# EAGLE schematic rozrobene_rfid_esp32 (EAGLE 9.0.1)
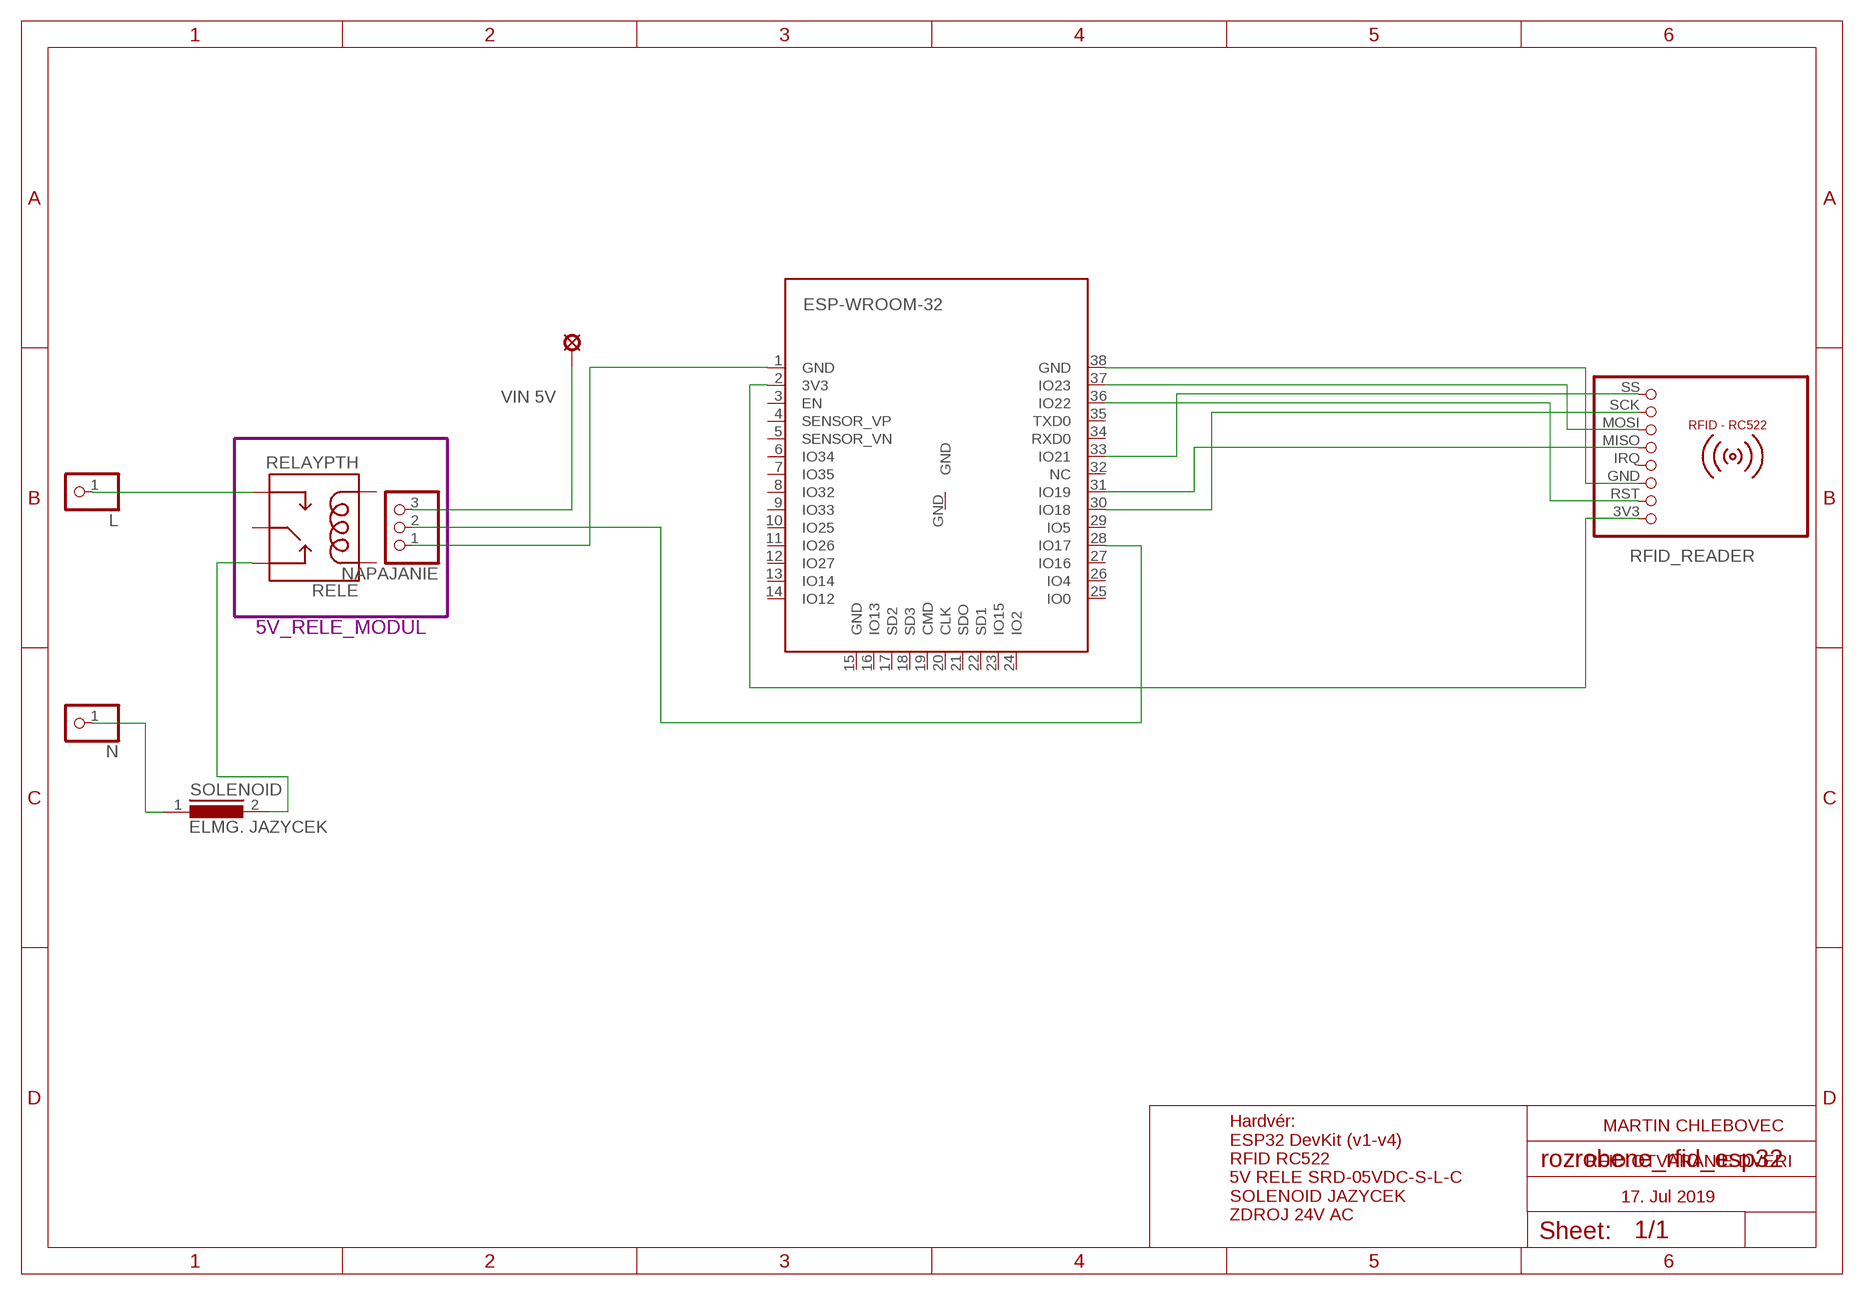
[diagram p0: schematic, sheet 1]

## Parts
L  PINHD-1X1CB  [1X01-CLEANBIG]
LSP1  LSP13  [LSP13]
N  PINHD-1X1CB  [1X01-CLEANBIG]
NAPAJANIE  PINHD-1X3  [1X03]
RELE  RELAYPTH  [SRD-05VDC-SL-C]
RFID_READER  RFID-RC522  [RFID-RC522]
SOLENOID  ELMG. JAZYCEK  SLF7045  [SLF7045]
U1  ESP-WROOM-32  [ESP-WROOM-32]

## Module instances
5V_RELE_MODUL = RELE

## Nets
N$1: RFID_READER.SS U1.33(IO21)
N$2: RFID_READER.MOSI U1.37(IO23)
N$3: RFID_READER.SCK U1.30(IO18)
N$4: RFID_READER.MISO U1.31(IO19)
N$5: RFID_READER.GND U1.38(GND)
N$6: RFID_READER.RST U1.36(IO22)
N$7: RFID_READER.3V3 U1.2(3V3)
N$8: NAPAJANIE.2 U1.28(IO17)
N$9: NAPAJANIE.1 U1.1(GND)
N$10: LSP1.MP NAPAJANIE.3
N$11: L.1 RELE.SWOPEN
N$12: N.1 SOLENOID.1
N$13: RELE.SWCLOSED(SWCLOSE) SOLENOID.2
Unconnected: RELE.COIL0 RELE.COIL1 RELE.SWCOMMON RFID_READER.IRQ U1.3(EN) U1.4(SENSOR_VP) U1.5(SENSOR_VN) U1.6(IO34) U1.7(IO35) U1.8(IO32) U1.9(IO33) U1.10(IO25) U1.11(IO26) U1.12(IO27) U1.13(IO14) U1.14(IO12) U1.15(GND) U1.16(IO13) U1.17(SD2) U1.18(SD3) U1.19(CMD) U1.20(CLK) U1.21(SDO) U1.22(SD1) U1.23(IO15) U1.24(IO2) U1.25(IO0) U1.26(IO4) U1.27(IO16) U1.29(IO5) U1.32(NC) U1.34(RXD0) U1.35(TXD0) U1.GND

## Notes on the sheet
- VIN 5V
- MARTIN CHLEBOVEC
- RFID OTVARANIE DVERI
- 17. Jul 2019
- Hardvér:
  ESP32 DevKit (v1-v4)
  RFID RC522
  5V RELE SRD-05VDC-S-L-C
  SOLENOID JAZYCEK
  ZDROJ 24V AC

## Library data of the parts
L N = adafruit:PINHD-1X1: Pin header 1x1 for 0.1" spacing With round pins
LSP1 = solpad:LSP13: SOLDER PAD drill 1.3 mm, distributor Buerklin, 12H562
NAPAJANIE = pinhead:PINHD-1X3: PIN HEADER
RELE = SRD-05VDC-SL-C:RELAY: SPDT relay (COM-00101)
RFID_READER = mfrc522-module:RFID-RC522: RFID-RC522 MFRC-522 based breakout board
SOLENOID = inductors:SLF7045: SMD Inductors(Coils) For Power Line (Wound, Magnetic Shielded) Source: TDK, e531_slf7045.pdf; SPICEPREFIX: L
U1 = esp32:ESP-WROOM-32

## Module RELE
Ports: 

### Library data of the parts